# Altium schematic sheet Copy of Sheet1.SchDoc
size A3; SheetNumber: 1; SheetTotal: 1
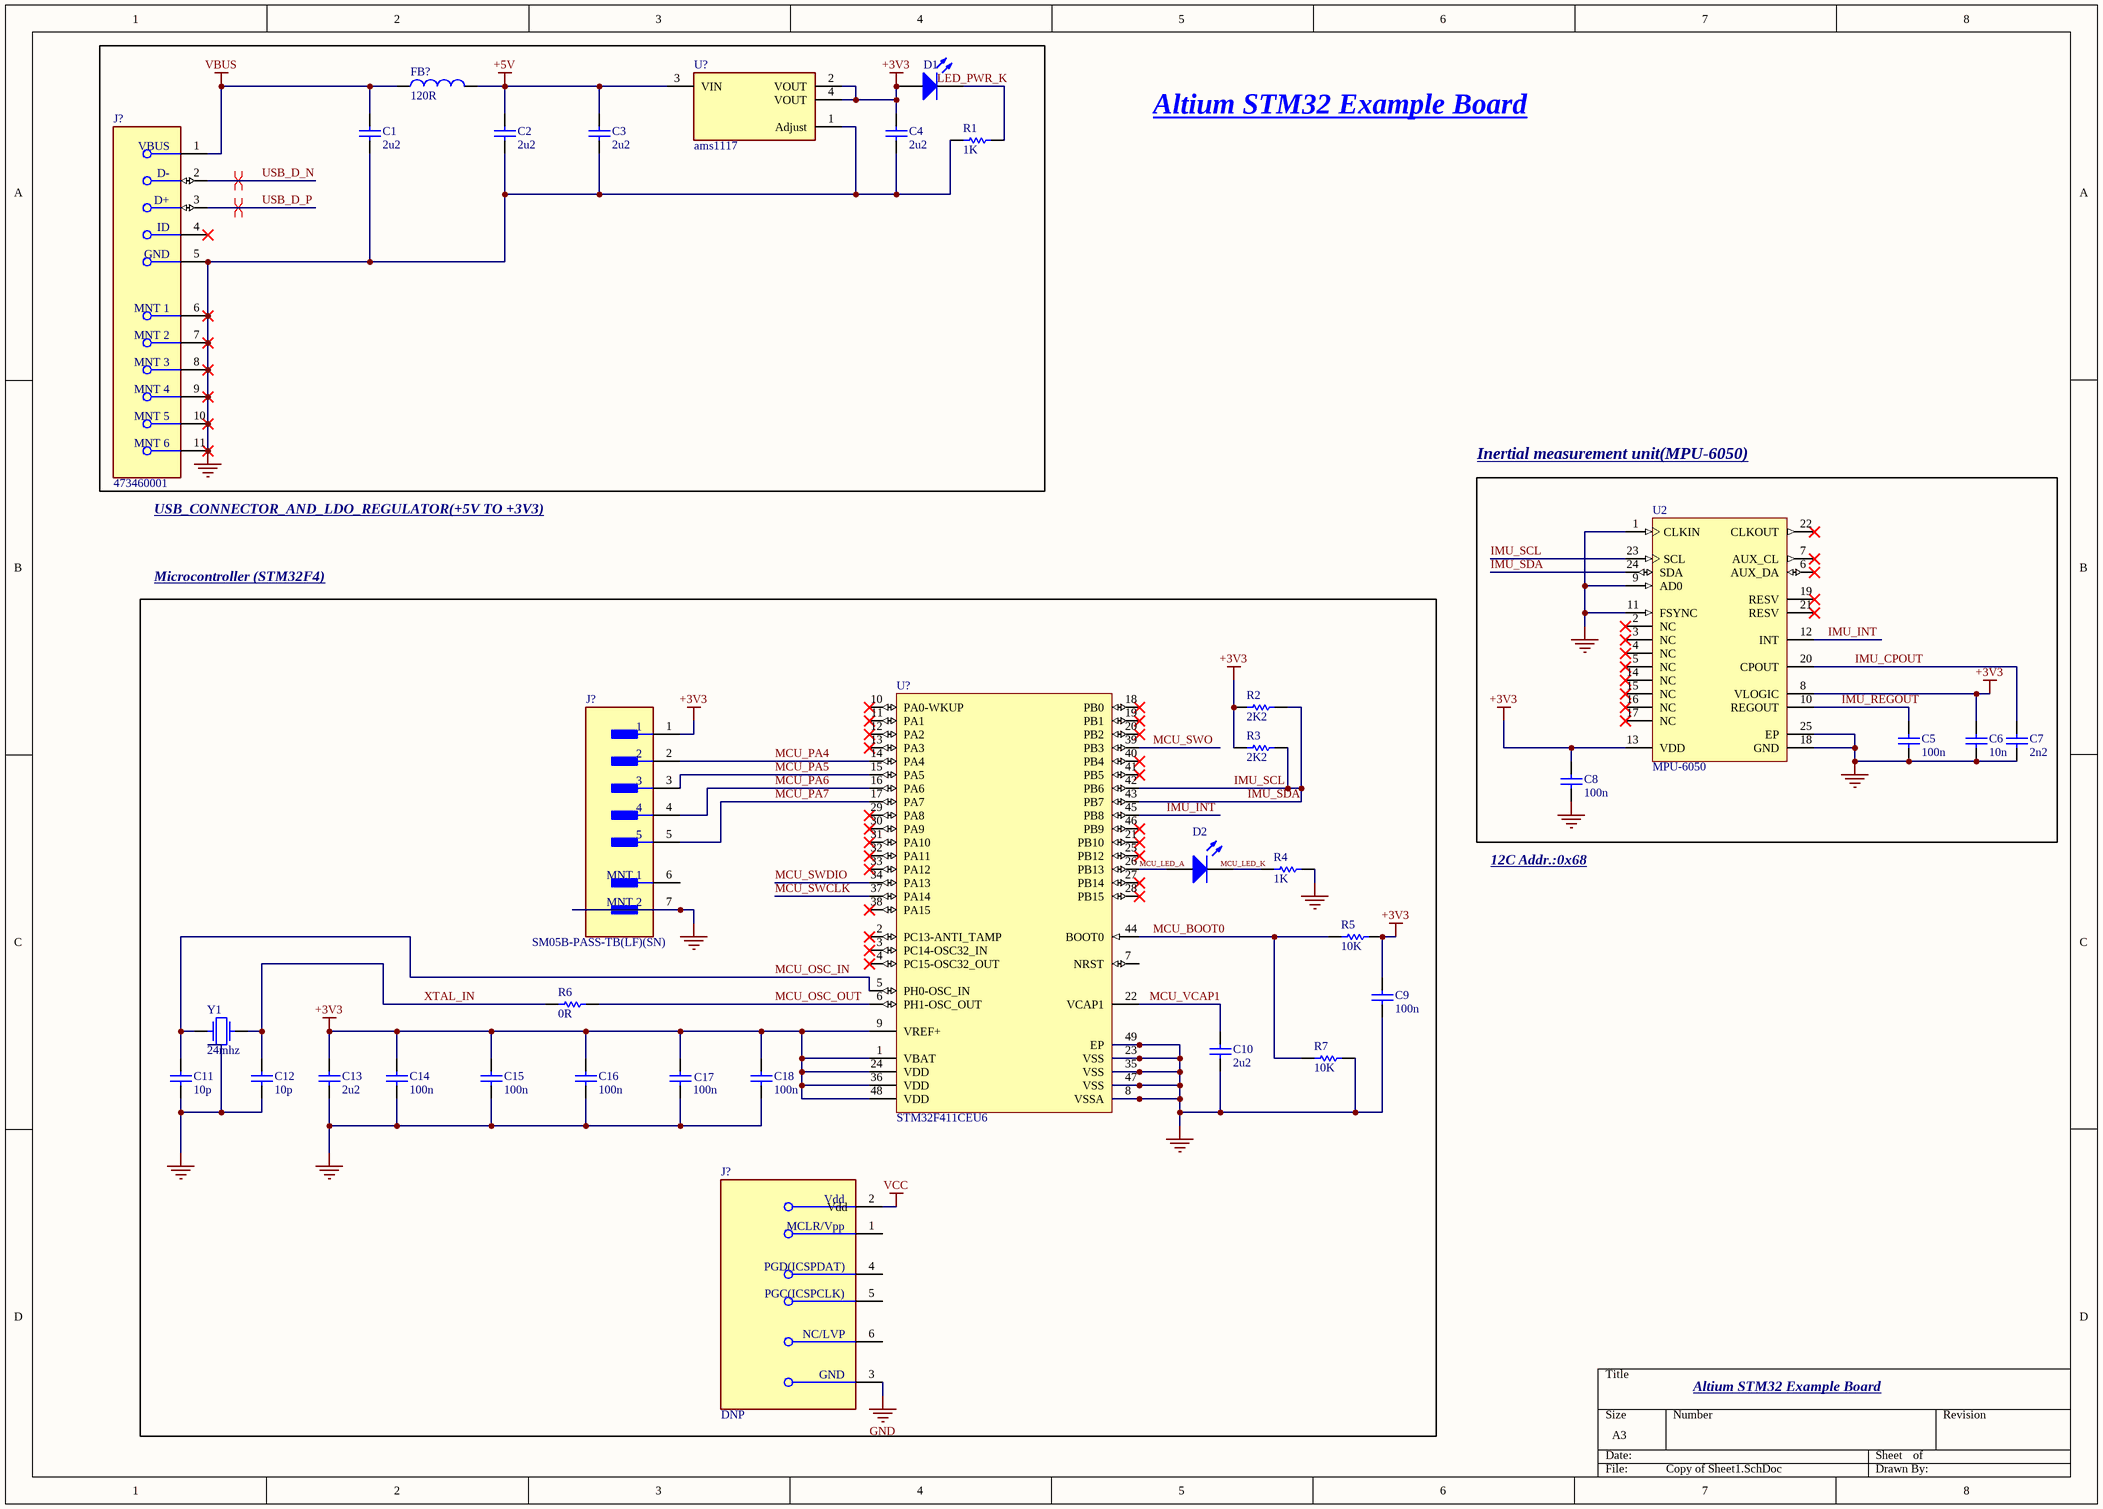
[diagram p0: Copy of Sheet1.SchDoc]

## Parts
(Parts that share a designator on the sheet are numbered #1, #2 ... from top to bottom, then left to right.)
C1  value 2u2  (hidden comment: Capacitor)
C2  value 2u2  (hidden comment: Capacitor)
C3  value 2u2  (hidden comment: Capacitor)
C4  value 2u2  (hidden comment: Capacitor)
C5  value 100n  (hidden comment: Capacitor)
C6  value 10n  (hidden comment: Capacitor)
C7  value 2n2  (hidden comment: Capacitor)
C8  value 100n  (hidden comment: Capacitor)
C9  value 100n  (hidden comment: Capacitor)
C10  value 2u2  (hidden comment: Capacitor)
C11  value 10p  (hidden comment: Capacitor)
C12  value 10p  (hidden comment: Capacitor)
C13  value 2u2  (hidden comment: Capacitor)
C14  value 100n  (hidden comment: Capacitor)
C15  value 100n  (hidden comment: Capacitor)
C16  value 100n  (hidden comment: Capacitor)
C17  value 100n  (hidden comment: Capacitor)
C18  value 100n  (hidden comment: Capacitor)
D1  Light-Emitting Diode  (value not drawn)
D2  Light-Emitting Diode  (value not drawn)
FB?  120R  [WE-CBF_0805_L2W1.2H0.9_HC]
J?#1  473460001  [FP-473460001-MFG]
J?#2  SM05B-PASS-TB(LF)(SN)  [FP-SM05B-PASS-TB_LF_SN-MFG]
J?#3  DNP  [FP-TC2030-MCP-NL-MFG]
R1  value 1K  (hidden comment: Resistor)
R2  value 2K2  (hidden comment: Resistor)
R3  value 2K2  (hidden comment: Resistor)
R4  value 1K  (hidden comment: Resistor)
R5  value 10K  (hidden comment: Resistor)
R6  value 0R  (hidden comment: Resistor)
R7  value 10K  (hidden comment: Resistor)
U2  MPU-6050  [IS-QFN-24_V]
U?#1  ams1117  [FP-ams1117-IPC_C]
U?#2  STM32F411CEU6  [STM-UFQFPN48_L]
Y1  F0: 24mhz  (hidden comment: Crystal)

## Blocks framed on the sheet
Inertial measurement unit(MPU-6050): C5-C8 U2
Microcontroller (STM32F4): C9-C18 D2 J?#2 J?#3 R2-R7 U?#2 Y1

## Nets
+3V3: C4.1 C6.1 C8.1 C9.1 C13.1 C14.1 C15.1 C16.1 C17.1 C18.1 D1.1(A) J?#2.1 R2.1 R3.1 R5.2 U2.8(VLOGIC) U2.13(VDD) U?#1.2(VOUT) U?#1.4(VOUT) U?#2.1(VBAT) U?#2.9(VREF+) U?#2.24(VDD) U?#2.36(VDD) U?#2.48(VDD)
+5V: C2.1 C3.1 FB?.2 U?#1.3(VIN)
GND: J?#3.3(GND)
NetC1_2: C1.2 C2.2 C3.2 C4.2 C5.2 C6.2 C7.2 C8.2 C9.2 C10.2 C11.2 C12.2 C13.2 C14.2 C15.2 C16.2 C17.2 C18.2 J?#1.5(GND) J?#1.6(MNT_1) J?#1.7(MNT_2) J?#1.8(MNT_3) J?#1.9(MNT_4) J?#1.10(MNT_5) J?#1.11(MNT_6) J?#2.7(MNT_2) R1.1 R4.2 R7.2 U2.1(CLKIN) U2.9(AD0) U2.11(FSYNC) U2.18(GND) U2.25(EP) U?#1.1(Adjust) U?#2.8(VSSA) U?#2.23(VSS) U?#2.35(VSS) U?#2.47(VSS) U?#2.49(EP)
VBUS: C1.1 FB?.1 J?#1.1(VBUS)
VCC: J?#3.2(Vdd)
IMU_CPOUT: C7.1 U2.20(CPOUT)
IMU_INT: U2.12(INT) U?#2.45(PB8)
IMU_REGOUT: C5.1 U2.10(REGOUT)
IMU_SCL: R2.2 R3.2 U2.23(SCL) U2.24(SDA) U?#2.42(PB6) U?#2.43(PB7)  [also labelled IMU_SDA]
MCU_BOOT0: R5.1 R7.1 U?#2.44(BOOT0)
MCU_LED_A: D2.1(A) U?#2.26(PB13)
MCU_OSC_IN: C11.1 U?#2.5(PH0-OSC_IN) Y1.1
MCU_OSC_OUT: R6.2 U?#2.6(PH1-OSC_OUT)
MCU_PA4: J?#2.2 U?#2.14(PA4)
MCU_PA5: J?#2.3 U?#2.15(PA5)
MCU_PA6: J?#2.4 U?#2.16(PA6)
MCU_PA7: J?#2.5 U?#2.17(PA7)
MCU_SWCLK: U?#2.37(PA14)
MCU_SWDIO: U?#2.34(PA13)
MCU_SWO: U?#2.39(PB3)
MCU_VCAP1: C10.1 U?#2.22(VCAP1)
USB_D_N: J?#1.2(D-)
USB_D_P: J?#1.3(D+)
XTAL_IN: C12.1 R6.1 Y1.2
NetD1_2: D1.2(K) R1.2
NetD2_2: D2.2(K) R4.1

Not connected (* = marked no-connect by the designer): J?#1 4(ID)*; J?#2 6(MNT_1); J?#3 1(MCLR/Vpp) 4(PGD(ICSPDAT)) 5(PGC(ICSPCLK)) 6(NC/LVP); U2 2(NC)* 3(NC)* 4(NC)* 5(NC)* 6(AUX_DA)* 7(AUX_CL)* 14(NC)* 15(NC)* 16(NC)* 17(NC)* 19(RESV)* 21(RESV)* 22(CLKOUT)*; U?#2 2(PC13-ANTI_TAMP)* 3(PC14-OSC32_IN)* 4(PC15-OSC32_OUT)* 7(NRST) 10(PA0-WKUP)* 11(PA1)* 12(PA2)* 13(PA3)* 18(PB0)* 19(PB1)* 20(PB2)* 21(PB10)* 25(PB12)* 27(PB14)* 28(PB15)* 29(PA8)* 30(PA9)* 31(PA10)* 32(PA11)* 33(PA12)* 38(PA15)* 40(PB4)* 41(PB5)* 46(PB9)*

## Layout directives
differential pair: USB_D_N, USB_D_P

## Notes on the sheet
- Altium STM32 Example Board
- (near J?#1) USB_CONNECTOR_AND_LDO_REGULATOR(+5V TO +3V3)
- 12C Addr.:0x68
- Labels drawn without touching a wire or pin: LED_PWR_K, MCU_LED_K

## Library data of the parts
C1-C18 = Capacitor: SimulationGenericComponent: True
D1 D2 = LED: AF: 1; BV: 0; BV_MAX: 1e99; EG: 1.11; FC: 0.5; IBV: 0.001; IS: 1e-14; MJSW: 0.33; NTUN: 30; TNOM: 27; XTI: 3; SimulationGenericComponent: True; CJO: 0; CJP: 0; CTA: 0; CTP: 0; FCS: 0.5; FV_MAX: 1e99; IKF: 0; IKR: 0; ISR: 1e-14; JSW: 0; JTUN: 0; JTUNSW: 0; KEG: 1; KF: 0; LEVEL: 1; N: 1; NBV: 1; NR: 1; NS: 1; PHP: 1; RS: 0; TCV: 0; TLEV: 0; TLEVC: 0; TM1: 0; TM2: 0; TPB: 0; TPHP: 0; TRS: 0; TRS2: 0; TT: 0; TTT1: 0; TTT2: 0; VJ: 1; XTITUN: 3
FB? = CMP-03913-130924299-1: 742792025 Ferrite Bead, Suppression, 120 Ohm, 5A Rohs Compliant: Yes; Current Rating: 3A; RoHS: Compliant; Min Operating Temperature: -55°C; Max Operating Temperature: 125°C; Length: 2mm; Width: 1.2mm; NexarPartId: 130924299; Height: 900µm
J?#1 = CMP-2000-05246-2: CONN RCPT USB2.0 MICRO B SMD R/A; Manufacturer: Molex; Conn Orientation: Right Angle; Is Female: yes; Shielding: true; Pitch: 0.65mm; Number Of Contacts: 5; Voltage Rating: 30V; Current Rating: 1.8A; Device Class L2: USB Connectors; Digikey Description: CONN RCPT USB2.0 MICRO B SMD R/A; Height: 2.945mm; RoHS: TRUE; ComponentLink2Description: Datasheet; Octopart: https://octopart.com/47346-0001-molex-7164928; Automotive: No; Package: 0; Category: Conn; Device Class L1: Connectors; Usb Standard: USB 2.0; Temperature: -30°C to +85°C; Temperature Range Low: -30°C; Footprint Url: https://www.molex.com/pdm_docs/sd/473460001_sd.pdf; ComponentLink2URL: https://www.molex.com/webdocs/datasheets/pdf/en-us/0473460001_IO_CONNECTORS.pdf; Lead Free: Yes; Manufacturer Part Number: 473460001; Contact Material: Gold,Nickel; Temperature Range High: +85°C; Device Class L3: unset
J?#2 = CMP-17439-000533-1: Wire-To-Board Connector, Pa Series, Surface Mount, Header, 5, 2 Mm, Tin Plated Contacts Rohs Compliant: Yes; Number of Positions: 5; Gender: Male; Pitch: 2mm; Termination: Crimp; Contact Plating: Tin; Number of Contacts: 5; Number of Rows: 1; Mount: Surface Mount; Packaging: Cut Tape; Reach SVHC Compliant: Yes; Contact Material: Copper; Color: Beige; Lead Free: Lead Free
J?#3 = CMP-205963-000002-1: CABLE TAG-CONNECT IN-CIRCUIT; RoHS Compliant: Yes; Series: -; Reach SVHC Compliant: Yes; Package Quantity: 1; Lead Free: Lead Free
R1-R7 = Resistor: TC1: 0; SimulationGenericComponent: True; TC2: 0
U2 = CMP-1753-00002-2: 3-Axis Gyroscope, Accelerometer and a Digital Motion Processor(TM) (DMP), 2.375 to 3.46 V, -40 to 85 degC, 24-Pin QFN, RoHS, Tape and Reel; Manufacturer: InvenSense; Featured Product: MPU-60506-Axis,IntegratedI²CSolution; Other Names: 1428-1007-2 / MPU6050; Sensor Type: MotionTracking; Online Catalog: MPU-6000™Series; Unit PriceUSD: Digital; Datasheet Version: Rev. 3.3, 05/2012; Category: Sensors,Transducers; Datasheet URL: http://datasheet.octopart.com/MPU-6050-InvenSense-datasheet-14421344.pdf; Family: Multifunction; Standard Package: 5,000; Manufacturer URL: http://www.invensense.com/; Output Type: Digital; Dynamic Catalog: MPU-6000™Series
U?#1 = CMP-209535-000002-1: 1A LOW DROPOUT VOLTAGE REGULATOR; RoHS Compliant: Yes
U?#2 = CMP-0243-00165-1: ARM Cortex-M4 32-bit MCU+FPU, 512 KB Flash, 128 KB RAM, 36 I/Os, 48-Pin UFQFPN, -40 to 85 degC, Tray; Operating Frequency(F) (Processor speed) (MHz): 100; FLASH Size (Prog) (kB): 512; Internal RAM Size (kB): 128; I/Os (High Current): 36; Supply Voltage(Vcc) min (V): 1.7; Package Reference: 48-Pin Ultra Thin Fine Pitch Quad Flat No-Lead, 7 x 7 x 0.6 mm Body, 0.5 mm Pitch, Exposed Pad; ComponentLink1Description: Manufacturer URL; ComponentLink1URL: http://www.st.com/; Packing: Tray; Package Description: UFQFPN48; Core: ARM Cortex-M4; ComponentLink2Description: Datasheet; ComponentLink2URL: http://www.st.com/st-web-ui/static/active/en/resource/technical/document/datasheet/DM00115249.pdf; DatasheetVersion: Rev. 6; Mounting Technology: Surface Mount
Y1 = Crystal: R: 500; Q: 50K; SimulationGenericComponent: True